# Altium schematic sheet board.SchDoc
size A3
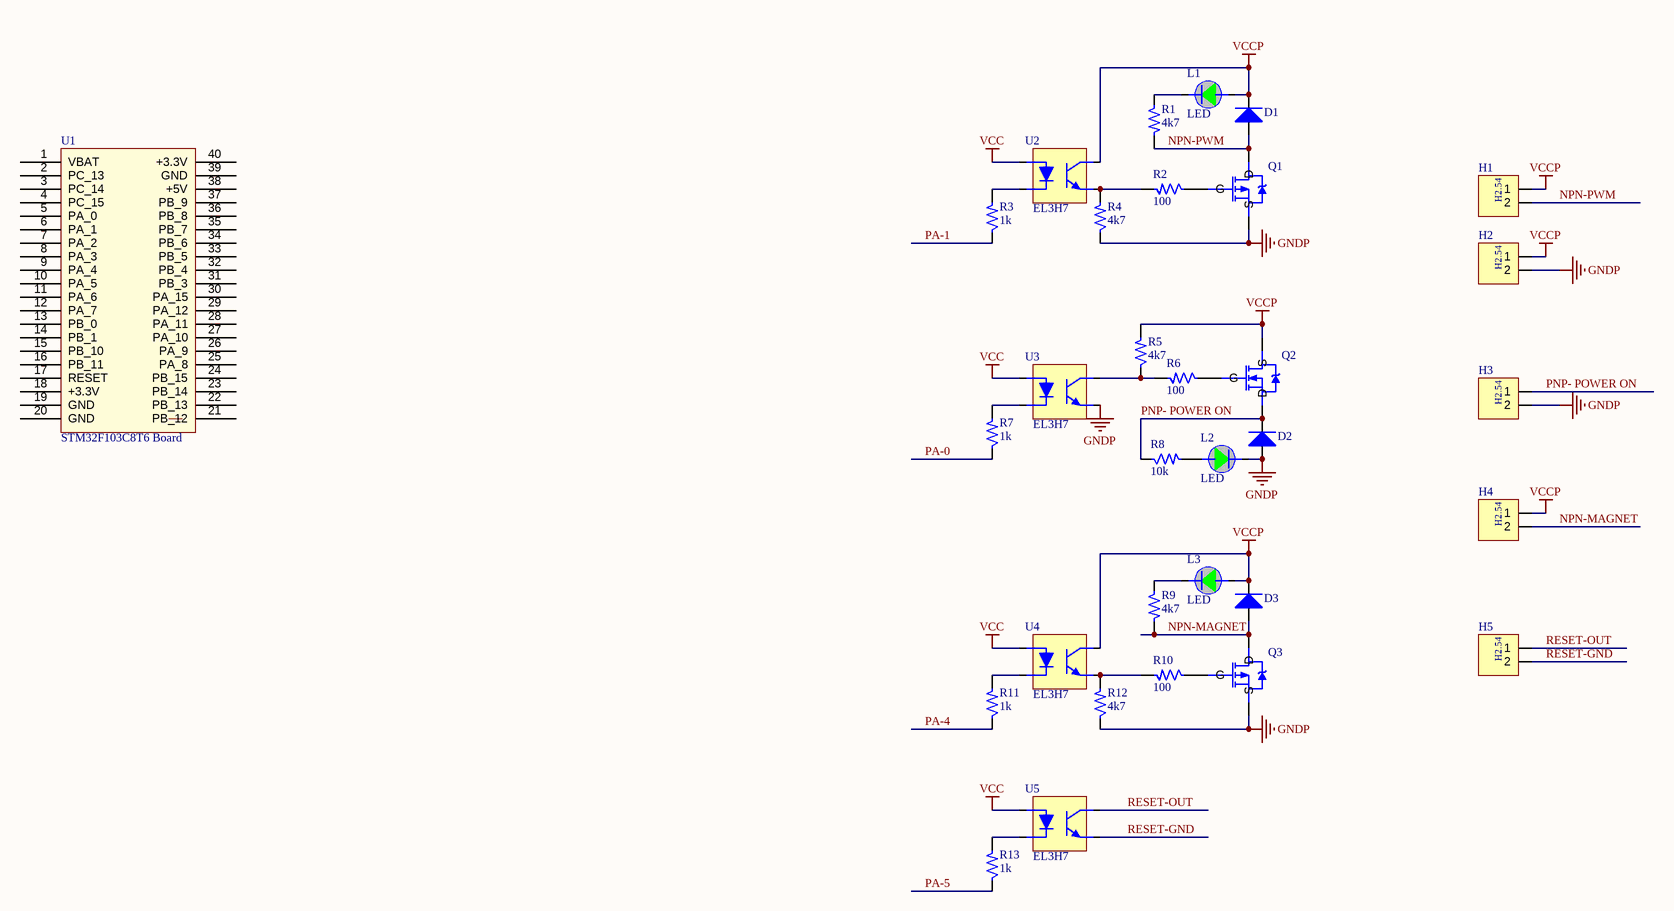
[diagram p0: board.SchDoc]

## Parts
D1  (no value)  [DIODE SS24 SMA]
D2  (no value)  [DIODE SS24 SMA]
D3  (no value)  [DIODE SS24 SMA]
H1  header 2.54mm 2p  [HEADER 2.54MM 2P]  (value not drawn)
H2  header 2.54mm 2p  [HEADER 2.54MM 2P]  (value not drawn)
H3  header 2.54mm 2p  [HEADER 2.54MM 2P]  (value not drawn)
H4  header 2.54mm 2p  [HEADER 2.54MM 2P]  (value not drawn)
H5  header 2.54mm 2p  [HEADER 2.54MM 2P]  (value not drawn)
L1  LED  [LED GREEN 0603 SMD]
L2  LED  [LED GREEN 0603 SMD]
L3  LED  [LED GREEN 0603 SMD]
Q1  MOSFET N  [AO3401 Mosfet P SOT23]  (value not drawn)
Q2  MOSFET P  [AO3401 Mosfet P SOT23]  (value not drawn)
Q3  MOSFET N  [AO3401 Mosfet P SOT23]  (value not drawn)
R1  4k7  [RES 0603]
R2  100  [RES 0603]
R3  1k  [RES 0603]
R4  4k7  [RES 0603]
R5  4k7  [RES 0603]
R6  100  [RES 0603]
R7  1k  [RES 0603]
R8  10k  [RES 0603]
R9  4k7  [RES 0603]
R10  100  [RES 0603]
R11  1k  [RES 0603]
R12  4k7  [RES 0603]
R13  1k  [RES 0603]
U1  STM32F103C8T6 Board  [STM32 Blue Pill]
U2  EL3H7  [SSOP4]
U3  EL3H7  [SSOP4]
U4  EL3H7  [SSOP4]
U5  EL3H7  [SSOP4]

## Nets
GNDP: D2.1(A) H2.2 H3.2 L2.2(Katot) Q1.2(S) Q3.2(S) R4.1 R12.1 U3.3
VCC: U2.1 U3.1 U4.1 U5.1
VCCP: D1.2(K) D3.2(K) H1.1 H2.1 H4.1 L1.1(anot) L3.1(anot) Q2.1(S) R5.2 U2.4 U4.4
NPN-MAGNET: D3.1(A) H4.2 Q3.1(D) R9.2
NPN-PWM: D1.1(A) H1.2 Q1.1(D) R1.2
PA-0: R7.1
PA-1: R3.1
PA-4: R11.1
PA-5: R13.1
PNP- POWER ON: D2.2(K) H3.1 Q2.2(D) R8.1
RESET-GND: H5.2 U5.3
RESET-OUT: H5.1 U5.4
NetL1_2: L1.2(Katot) R1.1
NetL2_1: L2.1(anot) R8.2
NetL3_2: L3.2(Katot) R9.1
NetQ1_3: Q1.3(G) R2.1
NetQ2_3: Q2.3(G) R6.1
NetQ3_3: Q3.3(G) R10.1
NetR2_2: R2.2 R4.2 U2.3
NetR3_2: R3.2 U2.2
NetR5_1: R5.1 R6.2 U3.4
NetR7_2: R7.2 U3.2
NetR10_2: R10.2 R12.2 U4.3
NetR11_2: R11.2 U4.2
NetR13_2: R13.2 U5.2

Not connected (* = marked no-connect by the designer): U1 1(VBAT) 2(PC_13) 3(PC_14) 4(PC_15) 5(PA_0) 6(PA_1) 7(PA_2) 8(PA_3) 9(PA_4) 10(PA_5) 11(PA_6) 12(PA_7) 13(PB_0) 14(PB_1) 15(PB_10) 16(PB_11) 17(RESET) 18(+3.3V) 19(GND) 20(GND) 21(PB_12) 22(PB_13) 23(PB_14) 24(PB_15) 25(PA_8) 26(PA_9) 27(PA_10) 28(PA_11) 29(PA_12) 30(PA_15) 31(PB_3) 32(PB_4) 33(PB_5) 34(PB_6) 35(PB_7) 36(PB_8) 37(PB_9) 38(+5V) 39(GND) 40(+3.3V)

## Notes on the sheet
- DWG. NO.
- REV.
- SHT.
- REVISION
- DESCRIPTION
- DATE
- APPROVED
- THIS DOCUMENT AND THE DATA DISCLOSED HEREIN OR HEREWITH IS THE PROPERTY OF ALTIUM LIMITED AND MAY BE FREELY DISTRIBUTED IN WHOLE. NO RIGHTS ARE RESERVED OR EXPRESS OR IMPLIED WARANTEE GIVEN.
- ENG:
- DSN:
- APPROVALS
- PROJECT
- DOCUMENT REVISION:
- DESIGN ITEM:
- CHK:
- BOM:
- REFERENCE DOCUMENTS
- PROJECT REVISION:
- TITLE
- FAB DWG:
- PCB DWG:
- ASSY DWG:
- SCALE:
- SIZE
- C
- CAGE CODE
- FILE NAME
- DWG NO.
- SHEET
- OF
- REV
- (in symbol header 2.54mm 2p) H2.54

## Library data of the parts
D1-D3 = diode SMA
L1-L3 = LED GREEN SMD
Q1 Q3 = MOSFET N AO3402
Q2 = MOSFET P AO3401
R1-R13 = res